# EAGLE design kiceker_board (EAGLE 9.6.2)
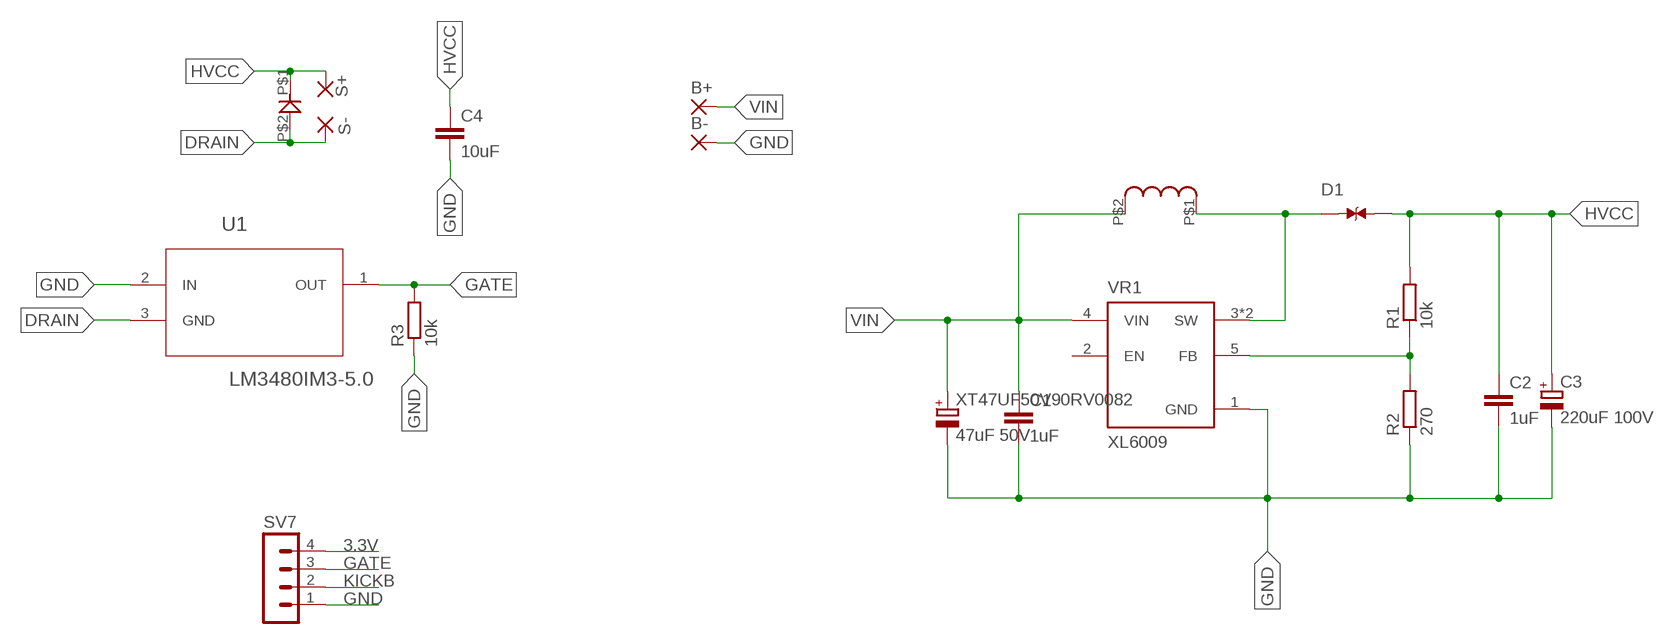
[diagram p0: schematic, sheet 1]

## Parts
B+  3,81/1,4  [3,81/1,4]
B-  3,81/1,4  [3,81/1,4]
C1  1uF  C-EUC0603  [C0603]
C2  1uF  C-EUC0603  [C0603]
C3  220uF 100V  CPOL-EUE5-5  [E5-5]
C4  10uF  C-EUC0603  [C0603]
D1  SMCJ15CA_V7G  [DIOM6859X262N]
R1  10k  R-EU_R0603  [R0603]
R2  270  R-EU_R0603  [R0603]
R3  10k  R-EU_R0603  [R0603]
S+  3,81/1,4  [3,81/1,4]
S-  3,81/1,4  [3,81/1,4]
SV7  MA04-1  [MA04-1]
U1  LM3480IM3-5.0  [SOT95P263X110-3N]
U$1  TMPC1265  [TMPC1265]
U$2  SMBF  [SMBF]
VR1  XL6009  [DPAK170P1435X465-6N]
XT47UF50V90RV0082  47uF 50V  CPOL-EU153CLV-0605  [153CLV-0605]

## Nets
3.3V: SV7.4
DRAIN: S-.1(P) U1.3(GND) U$2.P$2
GATE: R3.2 SV7.3 U1.1(OUT)
GND: B-.1(P) C1.2 C2.2 C3.- C4.2 R2.1 R3.1 SV7.1 U1.2(IN) VR1.1(GND) XT47UF50V90RV0082.-
HVCC: C2.1 C3.+ C4.1 D1.2 R1.2 S+.1(P) U$2.P$1
KICKB: SV7.2
N$2: D1.1 U$1.P$1 VR1.3(SW) VR1.6(SW)
N$4: R1.1 R2.2 VR1.5(FB)
VIN: B+.1(P) C1.1 U$1.P$2 VR1.4(VIN) XT47UF50V90RV0082.+
Unconnected: VR1.2(EN)

## Library data of the parts
B+ B- S+ S- = wirepad:3,81/1,4: THROUGH-HOLE PAD
C1 C2 C4 = rcl:C-EU: CAPACITOR, European symbol; SPICEPREFIX: C
C3 XT47UF50V90RV0082 = rcl:CPOL-EU: POLARIZED CAPACITOR, European symbol; SPICEPREFIX: C
D1 = B560C:SMCJ15CA_V7G: Check availability <https://pricing.snapeda.com/parts/SMCJ15CA%20V7G/Taiwan%20Semiconductor/view-part?ref=eda>; AVAILABILITY: In Stock; CHECK_PRICES: https://www.snapeda.com/parts/SMCJ15CA%20V7G/Taiwan+Semiconductor/view-part/?ref=eda; DESCRIPTION: 24.4V Clamp 64A Ipp Tvs Diode Surface Mount DO-214AB (SMC); MF: Taiwan Semiconductor; MP: SMCJ15CA V7G; PACKAGE: DO-214AB Taiwan Semiconductor Corporation; PRICE: None; SNAPEDA_LINK: https://www.snapeda.com/parts/SMCJ15CA%20V7G/Taiwan+Semiconductor/view-part/?ref=snap
R1-R3 = rcl:R-EU_: RESISTOR, European symbol; SPICEPREFIX: R
SV7 = con-lstb:MA04-1: PIN HEADER; OC_FARNELL: unknown; OC_NEWARK: unknown
U1 = SOT-23(FS5N10S):LM3480IM3-5.0: Linear Voltage Regulator Check availability <https://pricing.snapeda.com/parts/LM3480IM3-5.0/NOPB/Texas/view-part?ref=eda>; AVAILABILITY: In Stock; CHECK_PRICES: https://www.snapeda.com/parts/LM3480IM3-5.0/NOPB/Texas+Instruments/view-part/?ref=eda; DESCRIPTION: 100-mA, 30-V, low-dropout voltage regulator; MF: Texas; MP: LM3480IM3-5.0/NOPB; PACKAGE: SOT-23 Texas Instruments; PRICE: None; PURCHASE-URL: https://www.snapeda.com/api/url_track_click_mouser/?unipart_id=30350&manufacturer=Texas&part_name=LM3480IM3-5.0/NOPB&search_term=sot-23; SNAPEDA_LINK: https://www.snapeda.com/parts/LM3480IM3-5.0/NOPB/Texas+Instruments/view-part/?ref=snap
U$1 = TMPC1265:TMPC1265
U$2 = S5BBF:SMBF
VR1 = XL6009:XL6009: The XL6009 regulator is a wide input range, current mode, DC/DC converter which is capable of generating either positive or negative output voltages. Check availability <https://pricing.snapeda.com/parts/XL6009/XLSEMI/view-part?ref=eda>; AVAILABILITY: Not in stock; CHECK_PRICES: https://www.snapeda.com/parts/XL6009/XLSEMI/view-part/?ref=eda; DESCRIPTION: The XL6009 regulator is a wide input range, current mode, DC/DC converter which is capable of generating either positive or negative output voltages.; MF: XLSEMI; MP: XL6009; PACKAGE: TO-263-5L XLSEMI; PRICE: None; SNAPEDA_LINK: https://www.snapeda.com/parts/XL6009/XLSEMI/view-part/?ref=snap

## Board
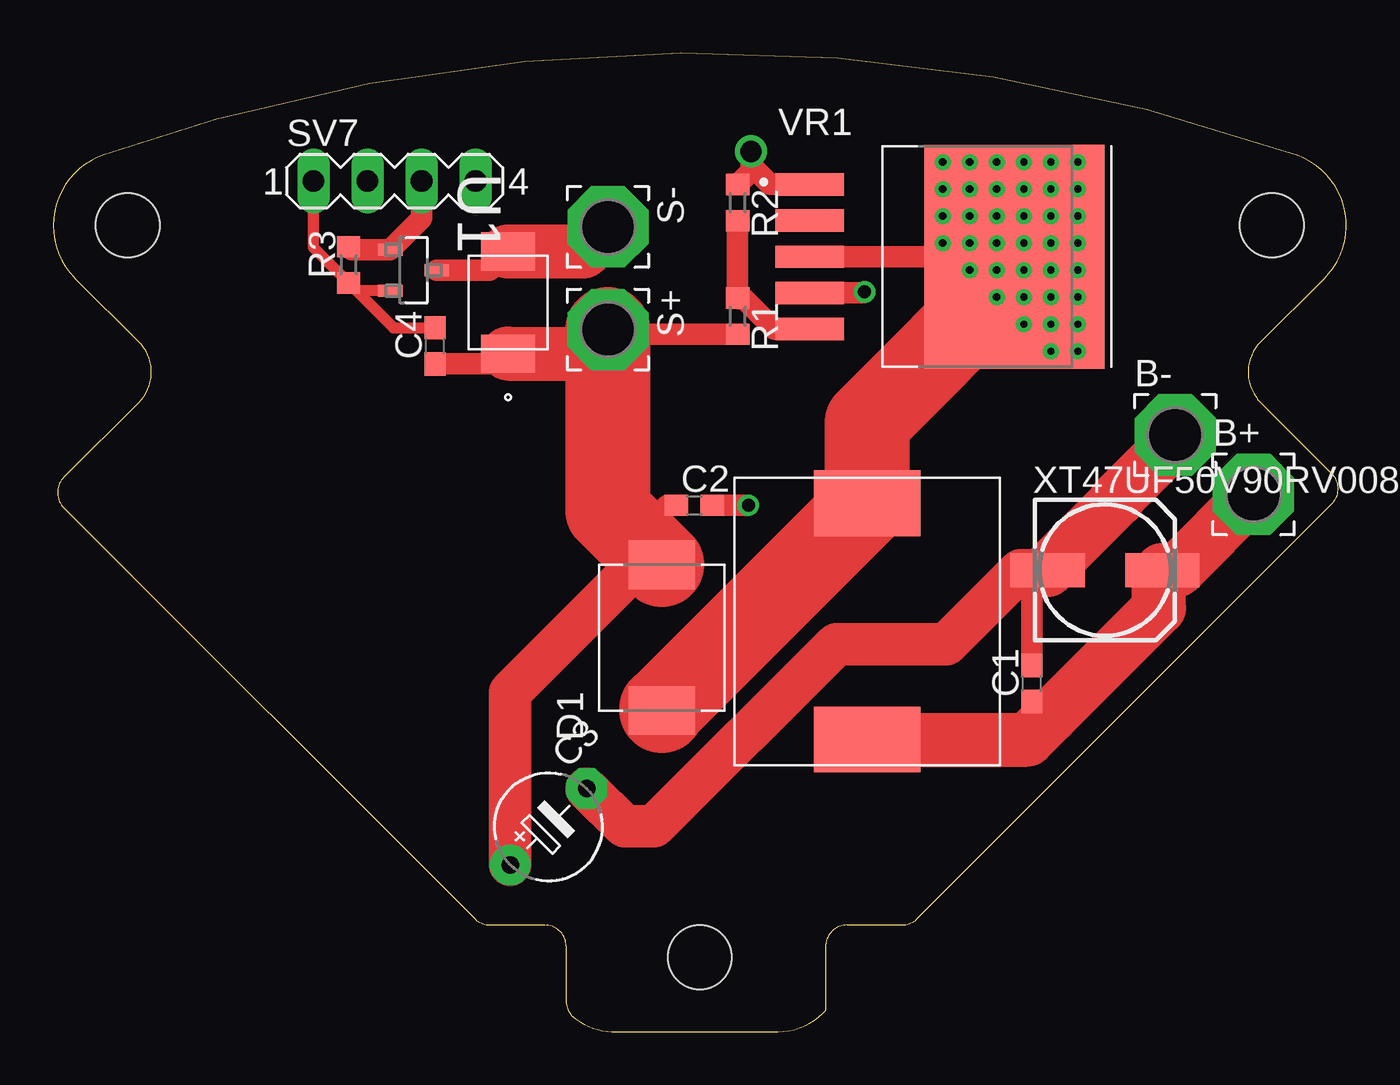
[diagram p1: board, top side]
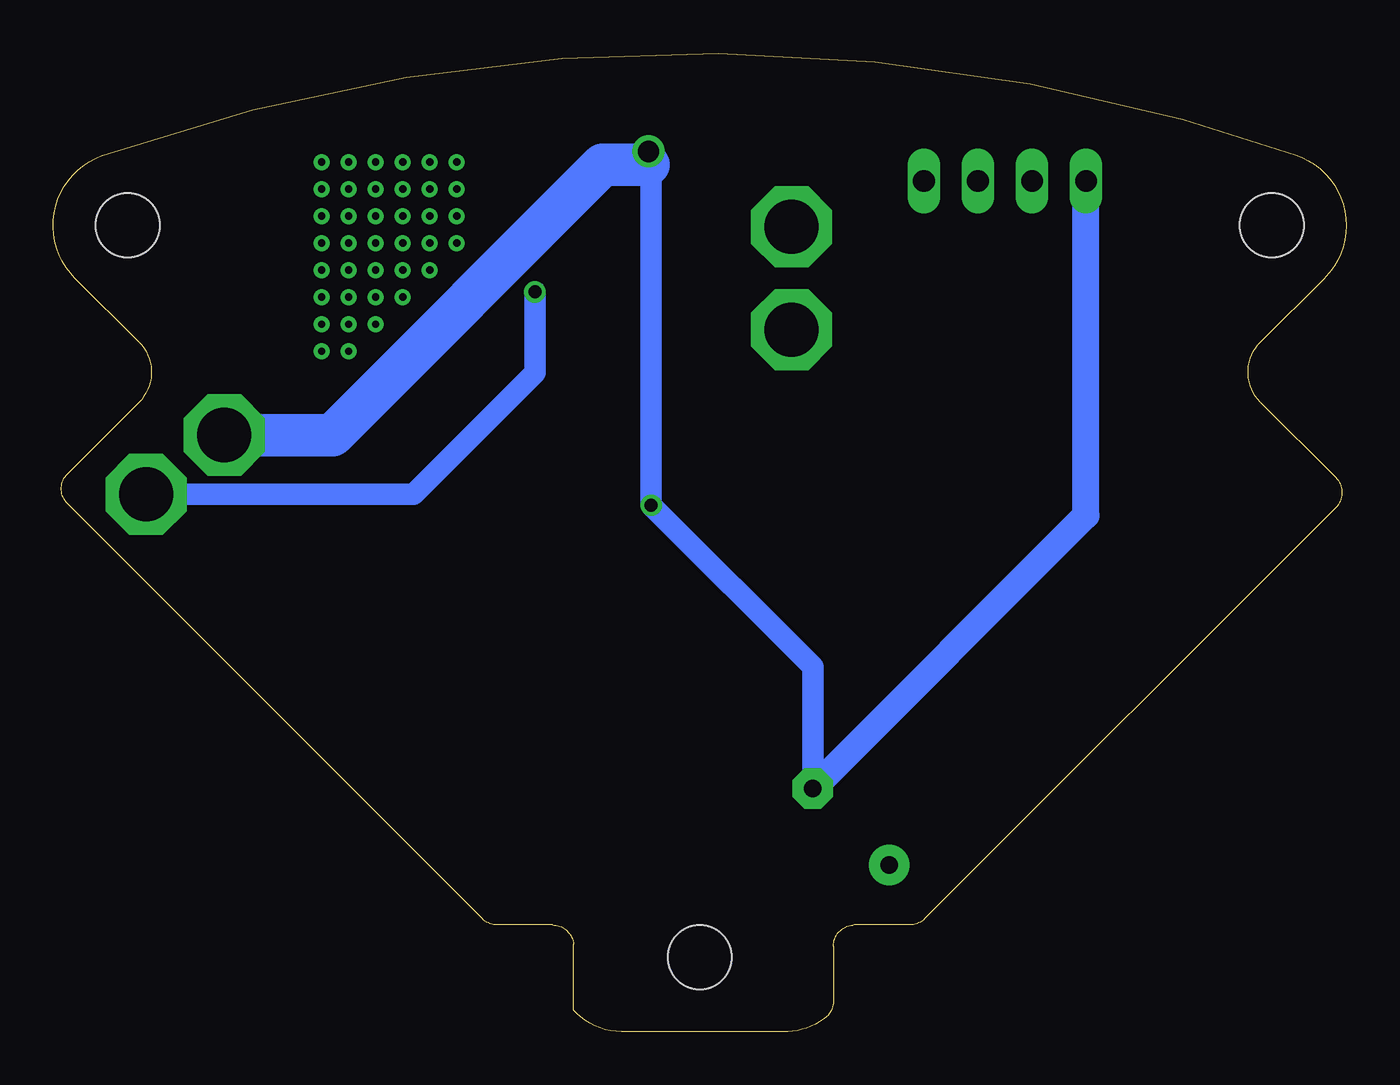
[diagram p2: board, bottom side, seen from below]

Size 60.81 x 46 mm. Coordinates in mm from the lower left corner, seen from the top.
Outline: 4.03,29.59 0.5,26.05 0.44,25.99 arc85 0.5,24.64 19.83,5.31 19.89,5.25 arc40 20.54,5.02 23.12,5.02 23.21,5.01 arc-85 24.12,4.02 24.12,1.43 24.12,1.34 arc35 24.36,0.79 24.36,0.78 24.56,0.62 24.78,0.47 arc30 26.26,0 26.38,0 34.07,0 34.33,0.01 arc40 36.19,0.88 36.33,1.02 36.33,4.02 36.34,4.1 arc-30 36.51,4.59 36.57,4.66 36.63,4.72 arc-45 37.33,5.02 39.92,5.02 40.01,5.02 arc40 40.63,5.31 60.13,24.81 60.19,24.88 arc85 60.13,26.23 56.77,29.59 56.65,29.72 arc-85 56.77,32.42 59.78,35.43 59.99,35.65 arc110 58.5,41.19 58.47,41.2 51.42,43.35 arc30 7.68,42.89 2.34,41.2 2.05,41.09 1.78,40.95 arc105 1,35.45 1.02,35.43 4.03,32.42 4.15,32.29 arc-85 4.03,29.59
Copper layers (1*16): Top 0.035mm / dielectric 1.5mm / Bottom 0.035mm
Design rules "default": minimum track width 6mil, minimum drill 0.35mm, track to track 6mil, track to pad 6mil, pad to pad 6mil, via to via 6mil, smd to smd 6mil, copper to edge 40mil, drill to drill 6mil, minimum pad ring 10mil, minimum via ring 8mil, stop-mask expansion 4mil, vias tented up to drill 0mil, thermal gap 10mil
Holes 3 mm at 30.4,3.5 57.31,37.9 3.5,37.9

### Footprints (pad centres in the part's own frame; a part is rotated, then mirrored left to right if it is on the bottom)
3,81/1,4 = drill 2.54 pad 3.81 octagon: 1 0,0
C0603 = smd 1.1 x 1: 1 -0.85,0; 2 0.85,0
E5-5 = drill 0.813 pad 1.905: + -2.54,0 | drill 0.813 pad 1.905 octagon: - 2.54,0
DIOM6859X262N = smd 2.29 x 3.12: 1 -3.43,0; 2 3.43,0
R0603 = smd 1 x 1.1: 1 -0.85,0; 2 0.85,0
MA04-1 = drill 1.016 long: 1 -3.81,0; 2 -1.27,0; 3 1.27,0; 4 3.81,0
SOT95P263X110-3N = smd 0.559 x 1.143: 1 -0.965,-1.092; 2 0.965,-1.092; 3 0,1.092
TMPC1265 = smd 3.1 x 5: P$1 5.55,0; P$2 -5.55,0
SMBF = smd 1.8 x 2.54: P$1 -2.4,0; P$2 2.4,0
DPAK170P1435X465-6N = smd 3.21 x 1.05: 1 -6.13,3.4; 2 -6.13,1.7; 3 -6.13,0; 4 -6.13,-1.7; 5 -6.13,-3.4 | smd 8.46 x 10.53: 6 3.5,0
153CLV-0605 = smd 3.5 x 1.6: + 2.7,0; - -2.7,0

### Placement (x,y rotation side)
B+  56.44,25.25 0 top
B-  52.76,28.05 0 top
C1  46.02,16.36 90 top
C2  30.15,24.75 0 top
C3  23.29,9.63 45 top
C4  17.96,32.24 90 top
D1  28.63,18.52 90 top
R1  32.18,33.64 270 top
R2  32.18,38.97 270 top
R3  13.89,36.05 90 top
S+  26.09,33 270 top
S-  26.09,37.83 270 top
SV7  16.05,39.99 0 top
U1  16.94,35.8 270 top
U$1  38.28,19.28 90 top
U$2  21.39,34.27 90 top
VR1  41.71,36.43 0 top
XT47UF50V90RV0082  49.45,21.7 0 top

### Tracks (layer width: path | path; a pad name or v marks a point on that pad's centre or on a via)
DRAIN
  Top 1: U1.3 20.51,35.8 U$2.P$2
  Top 2.54: S-.1 24.93,36.67 U$2.P$2
GATE
  Top 1: R3.2 14.03,36.76 U1.1 17.32,38.23 SV7.3
GND  (via drill 0.6, 1)
  Top 0.508: R3.1 16,33.09 C4.2 | R3.1 12.24,36.85 SV7.1 | U1.2 14.26,34.83 R3.1
  Top 1: C1.2 46.02,20.97 XT47UF50V90RV0082.- | v32.69,24.75 C2.2 | VR1.1 33.7,39.83 32.94,40.58 32.82,40.45 | R2.1 32.82,40.45 | v32.82,41.38 32.82,40.45
  Top 2: C3.- 26.86,9.66 28.26,9.66 36.82,18.22 42,18.22 45.48,21.7 XT47UF50V90RV0082.-
  Top 2.54: XT47UF50V90RV0082.- 50.06,25 49.96,25 52.76,27.79 B-.1
  Bottom 1: C3.- 25.09,17.14 v32.69,24.75 32.69,40.99 32.94,41.25 | v32.82,41.38 32.82,40.75
  Bottom 1.27: C3.- 12.24,24.27 SV7.1
  Bottom 2: B-.1 47.68,28.05 34.98,40.75 32.82,40.75
HVCC
  Top 1: C2.1 28.88,24.75 27.36,23.22 | C4.1 20.9,31.39 U$2.P$1 | R1.2 26.3,32.79 S+.1
  Top 2: C3.+ 21.5,15.97 27.48,21.95 D1.2
  Top 2.54: U$2.P$1 24.96,31.87 S+.1
  Top 4: D1.2 27.36,23.22 26.09,24.49 S+.1
N$1  (via drill 0.35)
  other vias: 41.83,40.88
N$2
  Top 1: VR1.3 VR1.6
  Top 4: D1.1 28.63,15.18 U$1.P$1 38.28,28.64 45.21,35.57 VR1.6
N$3  (via drill 0.35)
  other vias: 43.1,40.88
N$4
  Top 1: R2.2 R1.1 32.22,34.45 32.49,34.45 33.91,33.03 VR1.5
N$5  (via drill 0.35)
  other vias: 44.37,40.88
N$6  (via drill 0.35)
  other vias: 45.64,40.88
N$7  (via drill 0.35)
  other vias: 46.91,40.88
N$8  (via drill 0.35)
  other vias: 48.18,40.88
N$9  (via drill 0.35)
  other vias: 48.18,39.61
N$10  (via drill 0.35)
  other vias: 46.91,39.61
N$11  (via drill 0.35)
  other vias: 45.64,39.61
N$12  (via drill 0.35)
  other vias: 44.37,39.61
N$13  (via drill 0.35)
  other vias: 43.1,39.61
N$14  (via drill 0.35)
  other vias: 41.83,39.61
N$15  (via drill 0.35)
  other vias: 41.83,38.33
N$16  (via drill 0.35)
  other vias: 43.1,38.33
N$17  (via drill 0.35)
  other vias: 44.37,38.33
N$18  (via drill 0.35)
  other vias: 45.64,38.33
N$19  (via drill 0.35)
  other vias: 46.91,38.33
N$20  (via drill 0.35)
  other vias: 48.18,38.33
N$21  (via drill 0.35)
  other vias: 48.18,37.06
N$22  (via drill 0.35)
  other vias: 46.91,37.06
N$23  (via drill 0.35)
  other vias: 45.64,37.06
N$24  (via drill 0.35)
  other vias: 44.37,37.06
N$25  (via drill 0.35)
  other vias: 43.1,37.06
N$26  (via drill 0.35)
  other vias: 41.83,37.06
N$27  (via drill 0.35)
  other vias: 43.1,35.8
N$28  (via drill 0.35)
  other vias: 44.37,35.8
N$29  (via drill 0.35)
  other vias: 45.64,35.8
N$30  (via drill 0.35)
  other vias: 46.91,35.8
N$31  (via drill 0.35)
  other vias: 48.18,35.8
N$32  (via drill 0.35)
  other vias: 48.18,34.53
N$33  (via drill 0.35)
  other vias: 46.91,34.53
N$34  (via drill 0.35)
  other vias: 45.64,34.53
N$35  (via drill 0.35)
  other vias: 44.37,34.53
N$36  (via drill 0.35)
  other vias: 45.64,33.25
N$37  (via drill 0.35)
  other vias: 46.91,33.25
N$38  (via drill 0.35)
  other vias: 48.18,33.25
N$39  (via drill 0.35)
  other vias: 48.18,31.98
N$40  (via drill 0.35)
  other vias: 46.91,31.98
VIN  (via drill 0.6)
  Top 0.508: C1.1 46.24,15.51 46.92,14.84 | 46.92,14.84
  Top 1: VR1.4 38.1,34.73 v38.15,34.78
  Top 2.54: B+.1 52.88,21.7 52.5,21.7 | 52.5,21.7 XT47UF50V90RV0082.+ | U$1.P$2 45.82,13.73 46.92,14.84 51.99,19.91 51.99,21.19 52.5,21.7
  Bottom 1: v38.15,34.78 38.15,30.97 43.87,25.25 B+.1